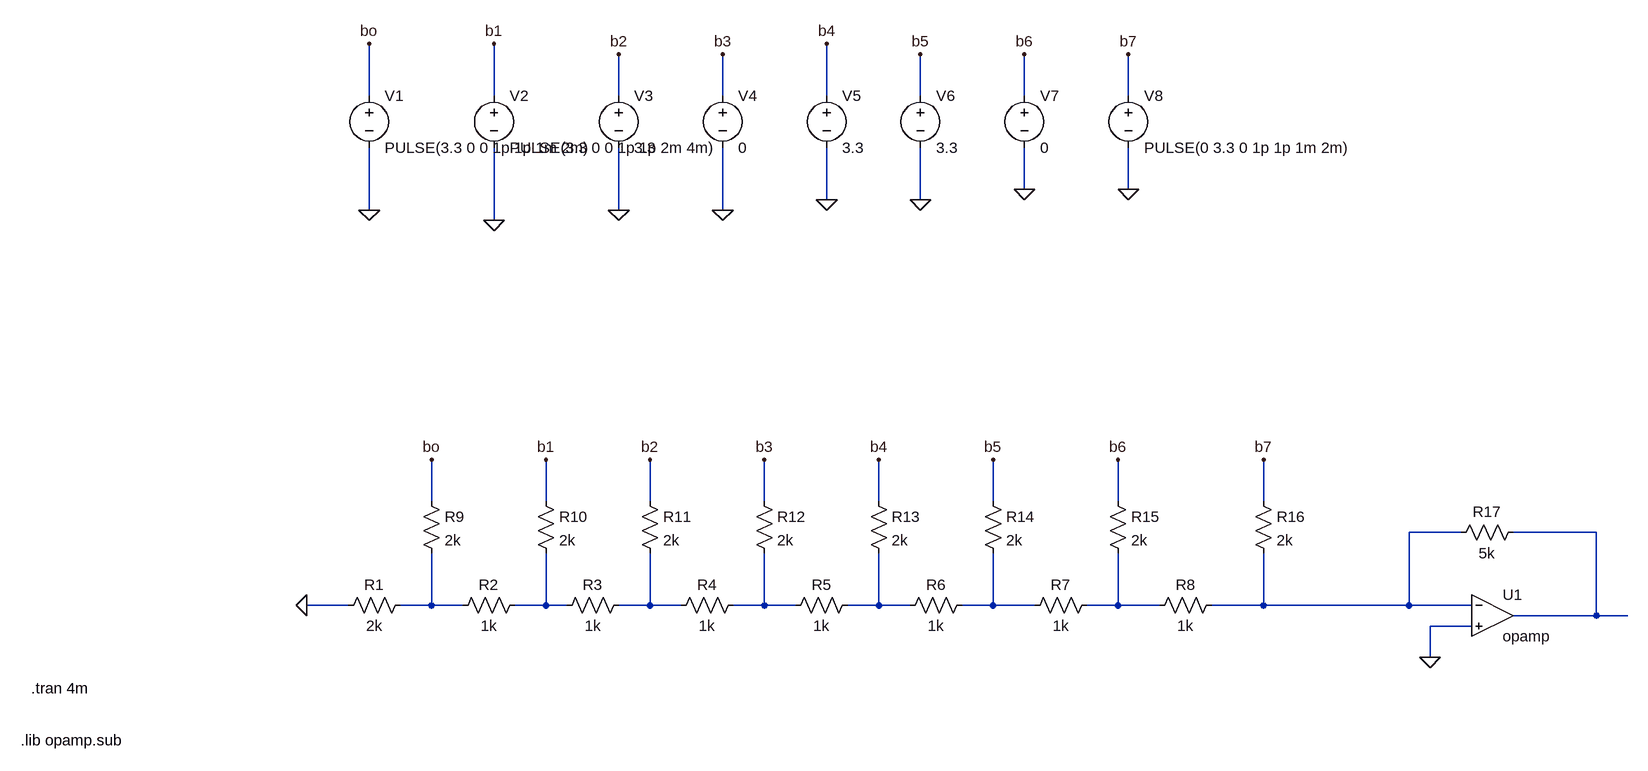
[diagram p0: schematic Draft2.asc]
Draft2.asc, the LTspice schematic file:
Version 4
SHEET 1 2020 680
WIRE 80 -592 80 -672
WIRE 272 -592 272 -672
WIRE 464 -592 464 -656
WIRE 624 -592 624 -656
WIRE 784 -592 784 -672
WIRE 928 -592 928 -656
WIRE 1088 -592 1088 -656
WIRE 1248 -592 1248 -656
WIRE 1088 -448 1088 -512
WIRE 1248 -448 1248 -512
WIRE 784 -432 784 -512
WIRE 928 -432 928 -512
WIRE 80 -416 80 -512
WIRE 464 -416 464 -512
WIRE 624 -416 624 -512
WIRE 272 -400 272 -512
WIRE 176 32 176 -32
WIRE 352 32 352 -32
WIRE 512 32 512 -32
WIRE 688 32 688 -32
WIRE 864 32 864 -32
WIRE 1040 32 1040 -32
WIRE 1232 32 1232 -32
WIRE 1456 32 1456 -32
WIRE 1760 80 1680 80
WIRE 1968 80 1840 80
WIRE 48 192 -16 192
WIRE 176 192 176 112
WIRE 176 192 128 192
WIRE 224 192 176 192
WIRE 352 192 352 112
WIRE 352 192 304 192
WIRE 384 192 352 192
WIRE 512 192 512 112
WIRE 512 192 464 192
WIRE 560 192 512 192
WIRE 688 192 688 112
WIRE 688 192 640 192
WIRE 736 192 688 192
WIRE 864 192 864 112
WIRE 864 192 816 192
WIRE 912 192 864 192
WIRE 1040 192 1040 112
WIRE 1040 192 992 192
WIRE 1104 192 1040 192
WIRE 1232 192 1232 112
WIRE 1232 192 1184 192
WIRE 1296 192 1232 192
WIRE 1456 192 1456 112
WIRE 1456 192 1376 192
WIRE 1680 192 1680 80
WIRE 1680 192 1456 192
WIRE 1776 192 1680 192
WIRE 1968 208 1968 80
WIRE 1968 208 1840 208
WIRE 2016 208 1968 208
WIRE 1776 224 1712 224
WIRE 1712 272 1712 224
FLAG -16 192 0
FLAG 80 -416 0
FLAG 272 -400 0
FLAG 464 -416 0
FLAG 624 -416 0
FLAG 784 -432 0
FLAG 928 -432 0
FLAG 1088 -448 0
FLAG 1248 -448 0
FLAG 80 -672 bo
FLAG 176 -32 bo
FLAG 272 -672 b1
FLAG 352 -32 b1
FLAG 464 -656 b2
FLAG 512 -32 b2
FLAG 688 -32 b3
FLAG 864 -32 b4
FLAG 1040 -32 b5
FLAG 1232 -32 b6
FLAG 1456 -32 b7
FLAG 1248 -656 b7
FLAG 1088 -656 b6
FLAG 928 -656 b5
FLAG 784 -672 b4
FLAG 624 -656 b3
FLAG 1712 272 0
SYMBOL res 144 176 R90
WINDOW 0 0 56 VBottom 2
WINDOW 3 32 56 VTop 2
SYMATTR InstName R1
SYMATTR Value 2k
SYMBOL res 320 176 R90
WINDOW 0 0 56 VBottom 2
WINDOW 3 32 56 VTop 2
SYMATTR InstName R2
SYMATTR Value 1k
SYMBOL res 480 176 R90
WINDOW 0 0 56 VBottom 2
WINDOW 3 32 56 VTop 2
SYMATTR InstName R3
SYMATTR Value 1k
SYMBOL res 656 176 R90
WINDOW 0 0 56 VBottom 2
WINDOW 3 32 56 VTop 2
SYMATTR InstName R4
SYMATTR Value 1k
SYMBOL res 832 176 R90
WINDOW 0 0 56 VBottom 2
WINDOW 3 32 56 VTop 2
SYMATTR InstName R5
SYMATTR Value 1k
SYMBOL res 1008 176 R90
WINDOW 0 0 56 VBottom 2
WINDOW 3 32 56 VTop 2
SYMATTR InstName R6
SYMATTR Value 1k
SYMBOL res 1200 176 R90
WINDOW 0 0 56 VBottom 2
WINDOW 3 32 56 VTop 2
SYMATTR InstName R7
SYMATTR Value 1k
SYMBOL res 1392 176 R90
WINDOW 0 0 56 VBottom 2
WINDOW 3 32 56 VTop 2
SYMATTR InstName R8
SYMATTR Value 1k
SYMBOL res 160 16 R0
SYMATTR InstName R9
SYMATTR Value 2k
SYMBOL res 336 16 R0
SYMATTR InstName R10
SYMATTR Value 2k
SYMBOL res 496 16 R0
SYMATTR InstName R11
SYMATTR Value 2k
SYMBOL res 672 16 R0
SYMATTR InstName R12
SYMATTR Value 2k
SYMBOL res 848 16 R0
SYMATTR InstName R13
SYMATTR Value 2k
SYMBOL res 1024 16 R0
SYMATTR InstName R14
SYMATTR Value 2k
SYMBOL res 1216 16 R0
SYMATTR InstName R15
SYMATTR Value 2k
SYMBOL res 1440 16 R0
SYMATTR InstName R16
SYMATTR Value 2k
SYMBOL voltage 80 -608 R0
WINDOW 123 0 0 Left 0
WINDOW 39 0 0 Left 0
SYMATTR InstName V1
SYMATTR Value PULSE(3.3 0 0 1p 1p 1m 2m)
SYMBOL voltage 272 -608 R0
WINDOW 123 0 0 Left 0
WINDOW 39 0 0 Left 0
SYMATTR InstName V2
SYMATTR Value PULSE(3.3 0 0 1p 1p 2m 4m)
SYMBOL voltage 464 -608 R0
WINDOW 123 0 0 Left 0
WINDOW 39 0 0 Left 0
SYMATTR InstName V3
SYMATTR Value 3.3
SYMBOL voltage 624 -608 R0
WINDOW 123 0 0 Left 0
WINDOW 39 0 0 Left 0
SYMATTR InstName V4
SYMATTR Value 0
SYMBOL voltage 784 -608 R0
WINDOW 123 0 0 Left 0
WINDOW 39 0 0 Left 0
SYMATTR InstName V5
SYMATTR Value 3.3
SYMBOL voltage 928 -608 R0
WINDOW 123 0 0 Left 0
WINDOW 39 0 0 Left 0
SYMATTR InstName V6
SYMATTR Value 3.3
SYMBOL voltage 1088 -608 R0
WINDOW 123 0 0 Left 0
WINDOW 39 0 0 Left 0
SYMATTR InstName V7
SYMATTR Value 0
SYMBOL voltage 1248 -608 R0
WINDOW 123 0 0 Left 0
WINDOW 39 0 0 Left 0
SYMATTR InstName V8
SYMATTR Value PULSE(0 3.3 0 1p 1p 1m 2m)
SYMBOL res 1856 64 R90
WINDOW 0 0 56 VBottom 2
WINDOW 3 32 56 VTop 2
SYMATTR InstName R17
SYMATTR Value 5k
SYMBOL Opamps\\opamp 1808 144 R0
SYMATTR InstName U1
TEXT -440 320 Left 2 !.tran 4m
TEXT -456 400 Left 2 !.lib opamp.sub

The netlist it stands for:
* Draft2.asc
R1 N003 0 2k
R2 N004 N003 1k
R3 N005 N004 1k
R4 N006 N005 1k
R5 N007 N006 1k
R6 N008 N007 1k
R7 N009 N008 1k
R8 N001 N009 1k
R9 bo N003 2k
R10 b1 N004 2k
R11 b2 N005 2k
R12 b3 N006 2k
R13 b4 N007 2k
R14 b5 N008 2k
R15 b6 N009 2k
R16 b7 N001 2k
V1 bo 0 PULSE(3.3 0 0 1p 1p 1m 2m)
V2 b1 0 PULSE(3.3 0 0 1p 1p 2m 4m)
V3 b2 0 3.3
V4 b3 0 0
V5 b4 0 3.3
V6 b5 0 3.3
V7 b6 0 0
V8 b7 0 PULSE(0 3.3 0 1p 1p 1m 2m)
R17 N002 N001 5k
XU1 N001 0 N002 opamp Aol=100K GBW=10Meg  ; pins invin noninvin out
.tran 4m
.lib opamp.sub
.backanno
.end